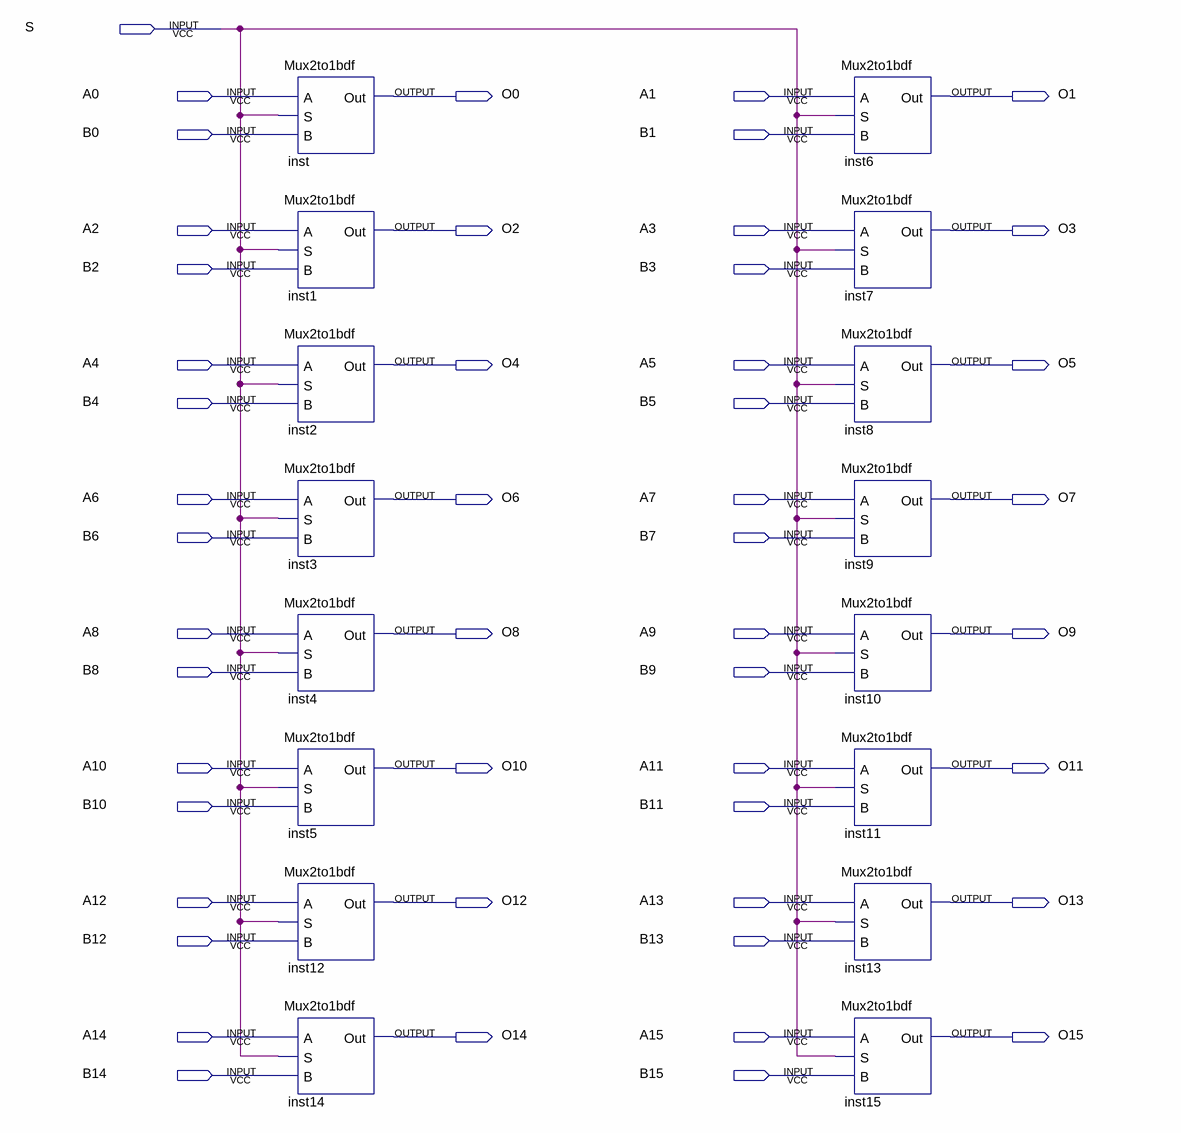
[diagram p0: schematic sheet]
// Quartus schematic Mux2to1_16bit.bdf as structural Verilog: 16 symbols, 49 pins
module Mux2to1_16bit (
  input  S,
  input  A0,
  input  A1,
  input  B0,
  input  B1,
  input  A2,
  input  A3,
  input  B2,
  input  B3,
  input  A4,
  input  A5,
  input  B4,
  input  B5,
  input  A6,
  input  A7,
  input  B6,
  input  B7,
  input  A8,
  input  A9,
  input  B8,
  input  B9,
  input  A10,
  input  A11,
  input  B10,
  input  B11,
  input  A12,
  input  A13,
  input  B12,
  input  B13,
  input  A14,
  input  A15,
  input  B14,
  input  B15,
  output O0,
  output O1,
  output O2,
  output O3,
  output O4,
  output O5,
  output O6,
  output O7,
  output O8,
  output O9,
  output O10,
  output O11,
  output O12,
  output O13,
  output O14,
  output O15
);

  Mux2to1bdf inst (.A(A0), .S(S), .B(B0), .Out(O0));
  Mux2to1bdf inst1 (.A(A2), .S(S), .B(B2), .Out(O2));
  Mux2to1bdf inst2 (.A(A4), .S(S), .B(B4), .Out(O4));
  Mux2to1bdf inst3 (.A(A6), .S(S), .B(B6), .Out(O6));
  Mux2to1bdf inst4 (.A(A8), .S(S), .B(B8), .Out(O8));
  Mux2to1bdf inst5 (.A(A10), .S(S), .B(B10), .Out(O10));
  Mux2to1bdf inst12 (.A(A12), .S(S), .B(B12), .Out(O12));
  Mux2to1bdf inst14 (.A(A14), .S(S), .B(B14), .Out(O14));
  Mux2to1bdf inst6 (.A(A1), .S(S), .B(B1), .Out(O1));
  Mux2to1bdf inst7 (.A(A3), .S(S), .B(B3), .Out(O3));
  Mux2to1bdf inst8 (.A(A5), .S(S), .B(B5), .Out(O5));
  Mux2to1bdf inst9 (.A(A7), .S(S), .B(B7), .Out(O7));
  Mux2to1bdf inst10 (.A(A9), .S(S), .B(B9), .Out(O9));
  Mux2to1bdf inst11 (.A(A11), .S(S), .B(B11), .Out(O11));
  Mux2to1bdf inst13 (.A(A13), .S(S), .B(B13), .Out(O13));
  Mux2to1bdf inst15 (.A(A15), .S(S), .B(B15), .Out(O15));
endmodule
